# EAGLE schematic MeterMaid (EAGLE 9.5.2)
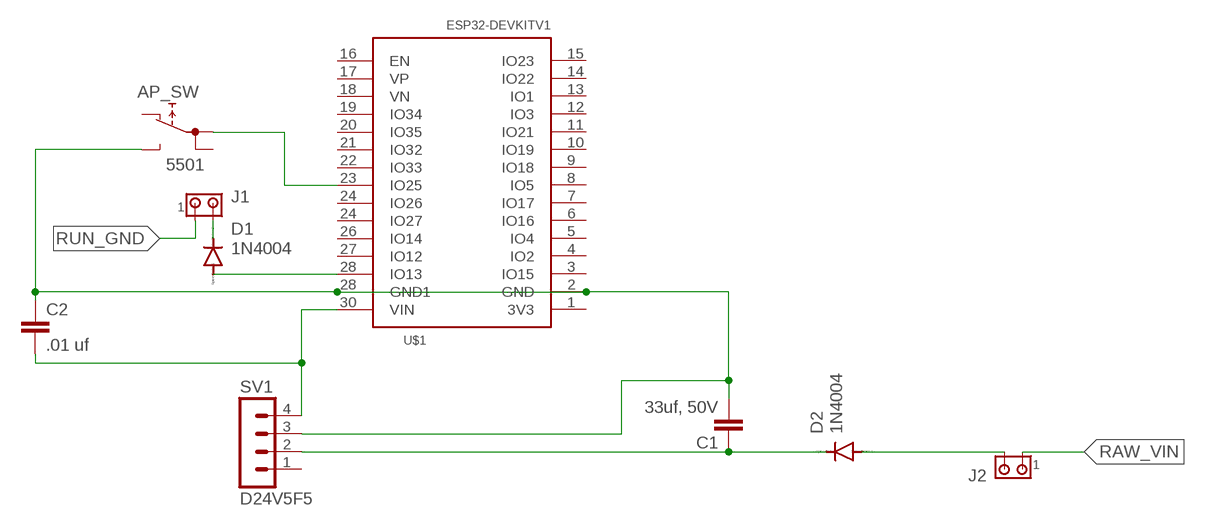
[diagram p0: schematic, sheet 1]

## Parts
AP_SW  5501  [5501]
C1  33uf, 50V  C-EU050-030X075  [C050-030X075]
C2  .01 uf  C2,5-3  [C2.5-3]
D1  1N4004  [DO41-10]
D2  1N4004  [DO41-10]
J1  MTA02-156  [1X2MTA]
J2  MTA02-156  [1X2MTA]
SV1  D24V5F5  MA04-1  [MA04-1]
U$1  ESP32DEVKITV1  [ESP32-DEVKITV1]

## Nets
5V_IN: C2.2 SV1.4 U$1.30(VIN)
GND: AP_SW.NO C1.2 C2.1 SV1.3 U$1.2(GND) U$1.28(GND1)
N$1: D1.C J1.2
N$3: D2.A J2.2
PIN13: D1.A U$1.28(IO13)
PIN25: AP_SW.1A U$1.23(IO25)
RAW_VIN: J2.1
RUN_GND: J1.1
VIN: C1.1 D2.C SV1.2
Unconnected: AP_SW.1B AP_SW.NC SV1.1 U$1.1(3V3) U$1.3(IO15) U$1.4(IO2) U$1.5(IO4) U$1.6(IO16) U$1.7(IO17) U$1.8(IO5) U$1.9(IO18) U$1.10(IO19) U$1.11(IO21) U$1.12(IO3) U$1.13(IO1) U$1.14(IO22) U$1.15(IO23) U$1.16(EN) U$1.17(VP) U$1.18(VN) U$1.19(IO34) U$1.20(IO35) U$1.21(IO32) U$1.22(IO33) U$1.24(IO26) U$1.24(IO27) U$1.26(IO14) U$1.27(IO12)

## Library data of the parts
AP_SW = switch:55?: PUSHBUTTON SERIES 5500 SWITCHES Source: www.e-switch.com .. 5500.pdf
C1 = rcl:C-EU: CAPACITOR, European symbol; SPICEPREFIX: C
C2 = capacitor-wima:C: CAPACITOR naming: grid - package width
D1 D2 = diode:1N4004: DIODE general purpose rectifier, 1 A
J1 J2 = con-amp:MTA02-156: AMP connector
SV1 = con-lstb:MA04-1: PIN HEADER; OC_FARNELL: unknown; OC_NEWARK: unknown
U$1 = ESP32-DEVKITV1:ESP32DEVKITV1